# Altium schematic sheet MichelleSheetv2.SchDoc
size A2
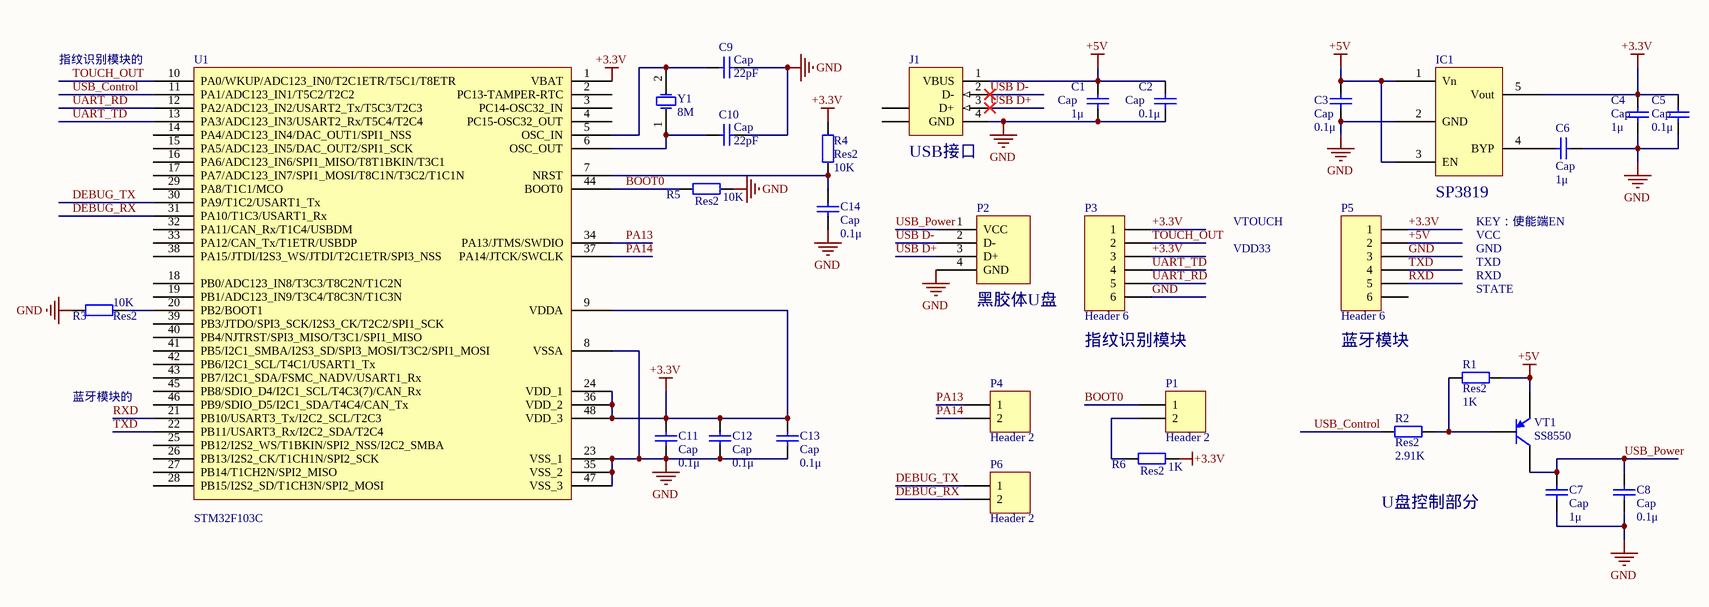
[diagram p0: MichelleSheetv2.SchDoc]

## Parts
C1  Cap  value 1μ  [c0603]
C2  Cap  value 0.1μ  [c0603]
C3  Cap  value 0.1μ  [c0603]
C4  Cap  value 1μ  [c0603]
C5  Cap  value 0.1μ  [c0603]
C6  Cap  value 1μ  [c0603]
C7  Cap  value 1μ  [c0603]
C8  Cap  value 0.1μ  [c0603]
C9  Cap  value 22pF  [c0603]
C10  Cap  value 22pF  [c0603]
C11  Cap  value 0.1μ  [c0603]
C12  Cap  value 0.1μ  [c0603]
C13  Cap  value 0.1μ  [c0603]
C14  Cap  value 0.1μ  [c0603]
IC1  SP3819  [SOT_23_5]
J1  USB接口  [USB_A(M)_SMD]
P1  Header 2  [HDR1X2]
P2  黑胶体U盘  [黑胶体U盘]
P3  Header 6  [SH1.0-6P-V]
P4  Header 2  [HDR1X2]
P5  Header 6  [HDR1X6]
P6  Header 2  [HDR1X2]
R1  Res2  value 1K  [r0603]
R2  Res2  value 2.91K  [r0603]
R3  Res2  value 10K  [r0603]
R4  Res2  value 10K  [r0603]
R5  Res2  value 10K  [r0603]
R6  Res2  value 1K  [r0603]
U1  STM32F103C  [LQFP_48]
VT1  SS8550  [SOT23_3]
Y1  8M  [HC-49SMD]

## Nets
+3.3V: C4.2 C5.2 C11.1 C12.1 C13.2 IC1.5(Vout) P3.1 P3.3 P5.1 R4.2 R6.1 U1.1(VBAT) U1.9(VDDA) U1.24(VDD_1) U1.36(VDD_2) U1.48(VDD_3)
+5V: C1.2 C2.2 C3.2 IC1.1(Vn) IC1.3(EN) J1.1(VBUS) P5.2 R1.2 VT1.1(E)
GND: C1.1 C2.1 C3.1 C4.1 C5.1 C6.1 C7.1 C8.1 C9.1 C10.1 C11.2 C12.2 C13.1 C14.2 IC1.2(GND) J1.4(GND) P2.4(GND) P3.6 P5.3 R3.2 R5.1 U1.8(VSSA) U1.23(VSS_1) U1.35(VSS_2) U1.47(VSS_3)
BOOT0: P1.1 R5.2 U1.44(BOOT0)
DEBUG_RX: P6.2 U1.31(PA10/T1C3/USART1_Rx)
DEBUG_TX: P6.1 U1.30(PA9/T1C2/USART1_Tx)
PA13: P4.1 U1.34(PA13/JTMS/SWDIO)
PA14: P4.2 U1.37(PA14/JTCK/SWCLK)
RXD: P5.5 U1.21(PB10/USART3_Tx/I2C2_SCL/T2C3)
TOUCH_OUT: P3.2 U1.10(PA0/WKUP/ADC123_IN0/T2C1ETR/T5C1/T8ETR)
TXD: P5.4 U1.22(PB11/USART3_Rx/I2C2_SDA/T2C4)
UART_RD: P3.5 U1.12(PA2/ADC123_IN2/USART2_Tx/T5C3/T2C3)
UART_TD: P3.4 U1.13(PA3/ADC123_IN3/USART2_Rx/T5C4/T2C4)
USB D+: J1.3(D+) P2.3(D+)
USB D-: J1.2(D-) P2.2(D-)
USB_Control: R2.1 U1.11(PA1/ADC123_IN1/T5C2/T2C2)
USB_Power: C7.2 C8.2 P2.1(VCC) VT1.3(C)
NetC6_2: C6.2 IC1.4(BYP)
NetC9_2: C9.2 U1.5(OSC_IN) Y1.2(OSC2)
NetC10_2: C10.2 U1.6(OSC_OUT) Y1.1(OSC1)
NetC14_1: C14.1 R4.1 U1.7(NRST)
NetP1_2: P1.2 R6.2
NetR1_1: R1.1 R2.2 VT1.2(B)
NetR3_1: R3.1 U1.20(PB2/BOOT1)

Not connected (* = marked no-connect by the designer): J1 5(SHLD) 6(SHLD); P5 6; U1 2(PC13-TAMPER-RTC) 3(PC14-OSC32_IN) 4(PC15-OSC32_OUT) 14(PA4/ADC123_IN4/DAC_OUT1/SPI1_NSS) 15(PA5/ADC123_IN5/DAC_OUT2/SPI1_SCK) 16(PA6/ADC123_IN6/SPI1_MISO/T8T1BKIN/T3C1) 17(PA7/ADC123_IN7/SPI1_MOSI/T8C1N/T3C2/T1C1N) 18(PB0/ADC123_IN8/T3C3/T8C2N/T1C2N) 19(PB1/ADC123_IN9/T3C4/T8C3N/T1C3N) 25(PB12/I2S2_WS/T1BKIN/SPI2_NSS/I2C2_SMBA) 26(PB13/I2S2_CK/T1CH1N/SPI2_SCK) 27(PB14/T1CH2N/SPI2_MISO) 28(PB15/I2S2_SD/T1CH3N/SPI2_MOSI) 29(PA8/T1C1/MCO) 32(PA11/CAN_Rx/T1C4/USBDM) 33(PA12/CAN_Tx/T1ETR/USBDP) 38(PA15/JTDI/I2S3_WS/JTDI/T2C1ETR/SPI3_NSS) 39(PB3/JTDO/SPI3_SCK/I2S3_CK/T2C2/SPI1_SCK) 40(PB4/NJTRST/SPI3_MISO/T3C1/SPI1_MISO) 41(PB5/I2C1_SMBA/I2S3_SD/SPI3_MOSI/T3C2/SPI1_MOSI) 42(PB6/I2C1_SCL/T4C1/USART1_Tx) 43(PB7/I2C1_SDA/FSMC_NADV/USART1_Rx) 45(PB8/SDIO_D4/I2C1_SCL/T4C3(7)/CAN_Rx) 46(PB9/SDIO_D5/I2C1_SDA/T4C4/CAN_Tx)

## Notes on the sheet
- 指纹识别模块的
- VTOUCH
- VDD33
- KEY：使能端EN
- VCC
- GND
- TXD
- RXD
- (near P3) 指纹识别模块
- (near P5) 蓝牙模块
- STATE
- 蓝牙模块的
- U盘控制部分

## Library data of the parts
C1-C14 = Cap: Capacitor; Published: 8-Jun-2000; LatestRevisionDate: 17-Jul-2002; LatestRevisionNote: Re-released for DXP Platform.; PackageReference: RAD-0.3; Publisher: Altium Limited; PackageDescription: Radial Cap, Thru-Hole; 2 Leads; 0.3 in Pin Spacing
J1 = 353583-4: USB 1.1, Right Angle, SMT, A Type, Receptacle, 4 Position, Black; ContactMaterial: Copper Alloy; ContactPlating: Gold over Palladium Nickel; PCB_Layout: Complies with manufacturer's recommendation.; DrillSize: Corresponds to nominal value.; PanelGround: Without; Published: 15-Jul-2004; DatasheetDocument: 11-Apr-2003; PackageDocument: 11-Apr-2003; PackageReference: 353583; Publisher: Altium Limited; HousingMaterial: Thermoplastic; ComponentLink1Description: Manufacturer Link; ComponentLink1URL: http://www.tycoelectronics.com/; ComponentLink2Description: Packaging Specification; ComponentLink2URL: http://ecommas.tycoelectronics.com/commerce/DocumentDelivery/DDEController?Action=showdoc&DocId=Customer+Drawing%7F353583%7FD%7Ftif%7FJapanese%7FJPN_CD_353583_D.tif
P1 P4 P6 = Header 2: Header, 2-Pin; LatestRevisionDate: 17-Jul-2002; LatestRevisionNote: Re-released for DXP Platform.; Publisher: Altium Limited
P3 = Header 6: 接插件; LatestRevisionDate: 17-Jul-2002; LatestRevisionNote: Re-released for DXP Platform.; Publisher: Altium Limited
P5 = Header 6: Header, 6-Pin; LatestRevisionDate: 17-Jul-2002; LatestRevisionNote: Re-released for DXP Platform.; Publisher: Altium Limited
R1-R6 = Res2: Resistor; Published: 8-Jun-2000; LatestRevisionDate: 17-Jul-2002; LatestRevisionNote: Re-released for DXP Platform.; PackageReference: AXIAL-0.4; Publisher: Altium Limited; PackageDescription: Axial Device, Thru-Hole; 2 Leads; 0.4 in Pin Spacing
U1 = STM32F103C: STM32单片机48引脚
VT1 = 2N3906: PNP General Purpose Amplifier; pin to pad: 1>2 2>1; Published: 8-Jun-2000; LatestRevisionDate: 15-Jan-2003; LatestRevisionNote: PCB Footprint 'BCY-W3/D4.7' replaced; DatasheetVersion: 1997; PackageVersion: Sep-1998; PackageReference: TO-92A; Publisher: Altium Limited; PackageDescription: TO, Flat Index; 3 In-Line, Axial Leads; Body Dia. 4.5mm; Leads 0.51 x 0.48 mm (max); ComponentLink1Description: Manufacturer Link; ComponentLink1URL: http://www.fairchildsemi.com/; ComponentLink2Description: Datasheet; ComponentLink2URL: http://www.fairchildsemi.com/ds/2N%2F2N3906.pdf
Y1 = XTAL: Crystal Oscillator; Published: 8-Jun-2000; LatestRevisionDate: 17-Jul-2002; LatestRevisionNote: Re-released for DXP Platform.; PackageReference: R38; Publisher: Altium Limited